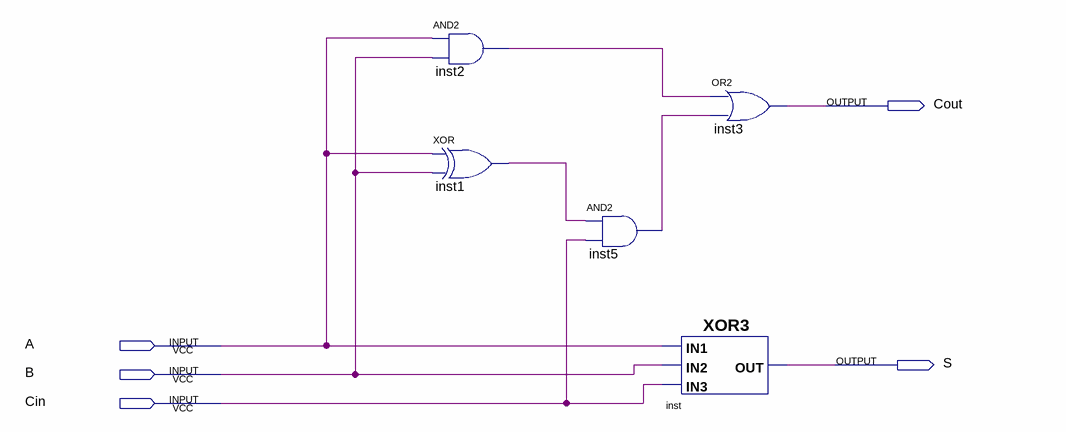
[diagram p0: schematic sheet]
// Quartus schematic FULL_ADDER.bdf as structural Verilog: 5 symbols, 5 pins
module FULL_ADDER (
  input  A,
  input  B,
  input  Cin,
  output Cout,
  output S
);

  wire inst1_out, inst2_out, inst5_out;

  and inst2 (inst2_out, A, B);
  xor inst1 (inst1_out, A, B);
  and inst5 (inst5_out, inst1_out, Cin);
  XOR3 inst (.IN3(Cin), .IN1(A), .IN2(B), .OUT(S));
  or inst3 (Cout, inst2_out, inst5_out);
endmodule
